# EAGLE design Schematic (EAGLE 9.1.0)
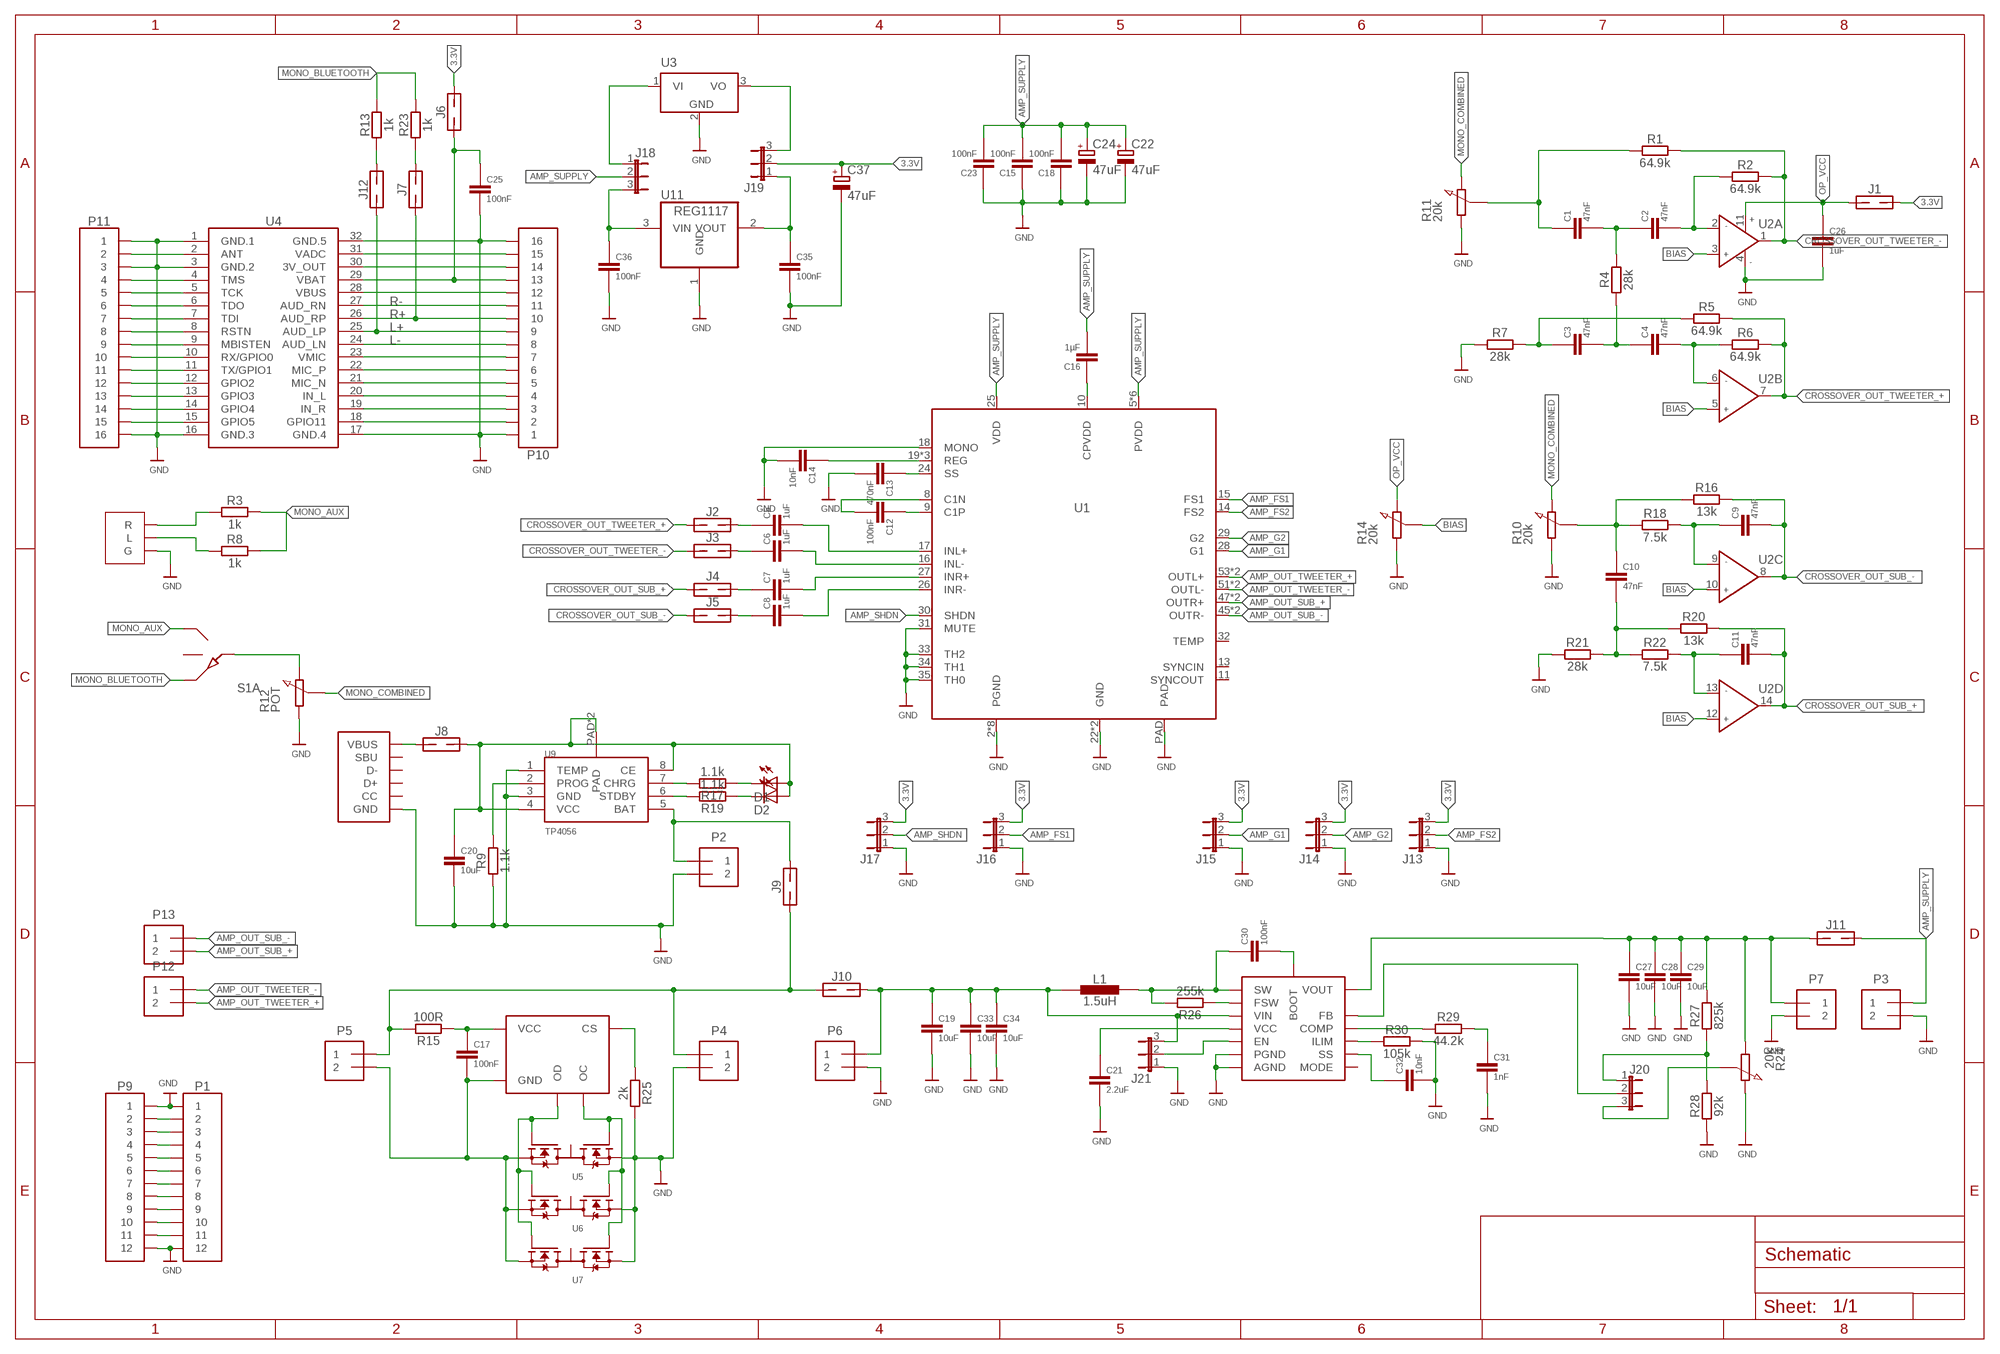
[diagram p0: schematic, sheet 1]

## Parts
C1  47nF  CAPACITOR  [R0603]
C2  47nF  CAPACITOR  [R0603]
C3  47nF  CAPACITOR  [R0603]
C4  47nF  CAPACITOR  [R0603]
C5  1uF  CAPACITOR  [R0603]
C6  1uF  CAPACITOR  [R0603]
C7  1uF  CAPACITOR  [R0603]
C8  1uF  CAPACITOR  [R0603]
C9  47nF  CAPACITOR  [R0603]
C10  47nF  CAPACITOR  [R0603]
C11  47nF  CAPACITOR  [R0603]
C12  100nF  CAPACITOR  [R0603]
C13  470nF  CAPACITOR  [R0603]
C14  10nF  CAPACITOR  [R0603]
C15  100nF  CAPACITOR  [R0603]
C16  1µF  CAPACITOR  [R0603]
C17  100nF  CAPACITOR  [R0603]
C18  100nF  CAPACITOR  [R0603]
C19  10uF  CAPACITOR1206  [1206]
C20  10uF  CAPACITOR1206  [1206]
C21  2.2uF  CAPACITOR  [R0603]
C22  47uF  CPOL-EUE2-4  [E2-4]
C23  100nF  CAPACITOR  [R0603]
C24  47uF  CPOL-EUE2-4  [E2-4]
C25  100nF  CAPACITOR  [R0603]
C26  1uF  CAPACITOR  [R0603]
C27  10uF  CAPACITOR1206  [1206]
C28  10uF  CAPACITOR1206  [1206]
C29  10uF  CAPACITOR1206  [1206]
C30  100nF  CAPACITOR  [R0603]
C31  1nF  CAPACITOR  [R0603]
C32  10nF  CAPACITOR  [R0603]
C33  10uF  CAPACITOR1206  [1206]
C34  10uF  CAPACITOR1206  [1206]
C35  100nF  CAPACITOR  [R0603]
C36  100nF  CAPACITOR  [R0603]
C37  47uF  CPOL-EUE2-4  [E2-4]
D1  LEDCHIPLED_0805  [CHIPLED_0805]
D2  LEDCHIPLED_0805  [CHIPLED_0805]
J1  JUMPER_2  [PIN_HEADER_2_2]
J2  JUMPER_2  [PIN_HEADER_2_2]
J3  JUMPER_2  [PIN_HEADER_2_2]
J4  JUMPER_2  [PIN_HEADER_2_2]
J5  JUMPER_2  [PIN_HEADER_2_2]
J6  JUMPER_2  [PIN_HEADER_2_2]
J7  JUMPER_2  [PIN_HEADER_2_2]
J8  JUMPER_2  [PIN_HEADER_2_2]
J9  JUMPER_2  [PIN_HEADER_2_2]
J10  JUMPER_2  [PIN_HEADER_2_2]
J11  JUMPER_2  [PIN_HEADER_2_2]
J12  JUMPER_2  [PIN_HEADER_2_2]
J13  JP2E  [JP2]
J14  JP2E  [JP2]
J15  JP2E  [JP2]
J16  JP2E  [JP2]
J17  JP2E  [JP2]
J18  JP2E  [JP2]
J19  JP2E  [JP2]
J20  JP2E  [JP2]
J21  JP2E  [JP2]
L1  1.5uH  INDUCTOR6519  [INDUCTOR2345]
P1  TYPE-_BREAKOUT  [TYPE-C]
P2  HEADER_2TERM  [SCREW_TERMINAL_2P]
P3  HEADER_2TERM  [SCREW_TERMINAL_2P]
P4  HEADER_2TERM  [SCREW_TERMINAL_2P]
P5  HEADER_2TERM  [SCREW_TERMINAL_2P]
P6  HEADER_2TERM  [SCREW_TERMINAL_2P]
P7  HEADER_2TERM  [SCREW_TERMINAL_2P]
P8  AUX  [AUDIO]
P9  HEADER_12  [HEADER_12]
P10  HEADER_16  [HEADER_16]
P11  HEADER_16  [HEADER_16]
P12  HEADER_2TERM  [SCREW_TERMINAL_2P]
P13  HEADER_2TERM  [SCREW_TERMINAL_2P]
P14  TYPE-C  [TYPE-C]
R1  64.9k  RESISTOR0603  [R0603]
R2  64.9k  RESISTOR0603  [R0603]
R3  1k  RESISTOR0603  [R0603]
R4  28k  RESISTOR0603  [R0603]
R5  64.9k  RESISTOR0603  [R0603]
R6  64.9k  RESISTOR0603  [R0603]
R7  28k  RESISTOR0603  [R0603]
R8  1k  RESISTOR0603  [R0603]
R9  1.1k  RESISTOR0603  [R0603]
R10  20k  POTTRIMMER  [TRIMMER]
R11  20k  POTTRIMMER  [TRIMMER]
R12  POT  [POT]
R13  1k  RESISTOR0603  [R0603]
R14  20k  POTTRIMMER  [TRIMMER]
R15  100R  RESISTOR0603  [R0603]
R16  13k  RESISTOR0603  [R0603]
R17  1.1k  RESISTOR0603  [R0603]
R18  7.5k  RESISTOR0603  [R0603]
R19  1.1k  RESISTOR0603  [R0603]
R20  13k  RESISTOR0603  [R0603]
R21  28k  RESISTOR0603  [R0603]
R22  7.5k  RESISTOR0603  [R0603]
R23  1k  RESISTOR0603  [R0603]
R24  20k  POTTRIMMER  [TRIMMER]
R25  2k  RESISTOR0603  [R0603]
R26  255k  RESISTOR0603  [R0603]
R27  825k  RESISTOR0603  [R0603]
R28  92k  RESISTOR0603  [R0603]
R29  44.2k  RESISTOR0603  [R0603]
R30  105k  RESISTOR0603  [R0603]
S1  SWITCH  [FE06]
U1  MAX9709  [TQFN-EP]
U2  MAX4478  [TSSOP-14]
U3  TSR12433  [TSR1]
U4  WIRELESS-BLUETOOTH-BK8000  [WIRELESS-BLUETOOTH-BK8000]
U5  FS8205  [SOP65P640X120-8N]
U6  FS8205  [SOP65P640X120-8N]
U7  FS8205  [SOP65P640X120-8N]
U8  FS312F  [TSOT23-6]
U9  TP4056  [SOP-8]
U10  TPS61088  [QFN50P450X350X100-21N]
U11  REG1117  [SOT223]

## Nets
3.3V: C37.+ J1.2 J6.2 J13.3 J14.3 J15.3 J16.3 J17.3 J19.2
AMP_FS1: J16.2 U1.15(FS1)
AMP_FS2: J13.2 U1.14(FS2)
AMP_G1: J15.2 U1.28(G1)
AMP_G2: J14.2 U1.29(G2)
AMP_OUT_SUB_+: P13.P$2 U1.47(OUTR+) U1.48(OUTR+)
AMP_OUT_SUB_-: P13.P$1 U1.45(OUTR-) U1.46(OUTR-)
AMP_OUT_TWEETER_+: P12.P$2 U1.53(OUTL+) U1.54(OUTL+)
AMP_OUT_TWEETER_-: P12.P$1 U1.51(OUTL-) U1.52(OUTL-)
AMP_SHDN: J17.2 U1.30(SHDN)
AMP_SUPPLY: C15.2 C16.2 C18.2 C22.+ C23.2 C24.+ J11.2 J18.2 P3.P$1 U1.5(PVDD) U1.6(PVDD) U1.7(PVDD) U1.25(VDD) U1.36(PVDD) U1.37(PVDD) U1.38(PVDD)
BIAS: R14.2 U2.3(A:IN+) U2.5(B:IN+) U2.10(C:IN+) U2.12(D:IN+)
CROSSOVER_OUT_SUB_+: C11.2 J4.1 R20.2 U2.14(D:OUT)
CROSSOVER_OUT_SUB_-: C9.2 J5.1 R16.2 U2.8(C:OUT)
CROSSOVER_OUT_TWEETER_+: J2.1 R5.2 R6.2 U2.7(B:OUT)
CROSSOVER_OUT_TWEETER_-: J3.1 R1.2 R2.2 U2.1(A:OUT)
GND: C13.2 C14.2 C15.1 C18.1 C19.2 C20.2 C21.2 C22.- C23.1 C24.- C25.2 C26.2 C27.2 C28.2 C29.2 C31.2 C32.2 C33.2 C34.2 C35.2 C36.2 C37.- J13.1 J14.1 J15.1 J16.1 J17.1 J21.1 P1.A1/B12 P1.B1/A12 P1.P$1 P1.P$2 P1.P$3 P1.P$4 P1.P$5 P1.P$6 P1.P$7 P1.P$8 P1.P$9 P1.P$10 P1.P$11 P1.P$12 P1.P$13 P1.P$14 P1.P$15 P1.P$16 P1.P$17 P1.P$18 P1.P$19 P1.P$20 P1.P$21 P1.P$22 P1.P$23 P1.P$24 P1.P$25 P1.P$26 P1.P$27 P1.P$28 P1.P$29 P1.P$30 P1.P$31 P1.P$32 P1.P$33 P1.P$34 P1.P$35 P1.P$36 P1.P$37 P1.P$38 P2.P$2 P3.P$2 P4.P$2 P6.P$2 P7.P$2 P8.P$3(G) P9.1 P9.12 P10.1 P10.16 P11.1 P11.3 P11.16 P14.A1/B12(GND) P14.B1/A12(GND) P14.P$1(GND) P14.P$2(GND) P14.P$3(GND) P14.P$4(GND) P14.P$5(GND) P14.P$6(GND) P14.P$7(GND) P14.P$8(GND) P14.P$9(GND) P14.P$10(GND) P14.P$11(GND) P14.P$12(GND) P14.P$13(GND) P14.P$14(GND) P14.P$15(GND) P14.P$16(GND) P14.P$17(GND) P14.P$18(GND) P14.P$19(GND) P14.P$20(GND) P14.P$21(GND) P14.P$22(GND) P14.P$23(GND) P14.P$24(GND) P14.P$25(GND) P14.P$26(GND) P14.P$27(GND) P14.P$28(GND) P14.P$29(GND) P14.P$30(GND) P14.P$31(GND) P14.P$32(GND) P14.P$33(GND) P14.P$34(GND) P14.P$35(GND) P14.P$36(GND) P14.P$37(GND) P14.P$38(GND) R7.1 R9.1 R10.1 R11.1 R12.1 R14.1 R21.1 R24.3 R25.2 R28.1 R30.2 U1.2(PGND) U1.3(PGND) U1.4(PGND) U1.18(MONO) U1.22(GND) U1.23(GND) U1.31(MUTE) U1.33(TH2) U1.34(TH1) U1.35(TH0) U1.39(PGND) U1.40(PGND) U1.41(PGND) U1.49(PGND) U1.50(PGND) U1.PAD U2.4(A:-) U3.2(GND) U4.1(GND.1) U4.3(GND.2) U4.16(GND.3) U4.17(GND.4) U4.32(GND.5) U5.6(S2) U5.7(S2) U6.6(S2) U6.7(S2) U7.6(S2) U7.7(S2) U9.1(TEMP) U9.3(GND) U10.20(AGND) U10.21(PGND) U10.22(PGND) U11.1(GND)
L+: J12.1 P10.9 U4.25(AUD_LP)
L-: P10.8 U4.24(AUD_LN)
MONO_AUX: R3.2 R8.2 S1.P$1
MONO_BLUETOOTH: R13.2 R23.2 S1.P$3
MONO_COMBINED: R10.3 R11.3 R12.2
N$1: C5.1 J2.2
N$2: C1.2 C2.1 R4.2
N$3: C2.2 R2.1 U2.2(A:IN-)
N$4: C1.1 R1.1 R11.2
N$5: C27.1 C28.1 C29.1 J11.1 P7.P$1 R24.1 R27.2 U10.14(VOUT) U10.15(VOUT) U10.16(VOUT)
N$6: C4.2 R6.1 U2.6(B:IN-)
N$7: C3.2 C4.1 R4.1
N$8: C3.1 R5.1 R7.2
N$9: C6.1 J3.2
N$10: C9.1 R18.2 U2.9(C:IN-)
N$11: C7.1 J4.2
N$12: C11.1 R22.2 U2.13(D:IN-)
N$13: C10.1 R10.2 R16.1 R18.1
N$14: C10.2 R20.1 R21.2 R22.1
N$15: C8.1 J5.2
N$16: C6.2 U1.16(INL-)
N$17: C36.1 J18.3 U11.3(VIN)
N$18: P8.P$1(L) R8.1
N$19: P8.P$2(R) R3.1
N$20: R12.3 S1.P$5(A:C)
N$21: C7.2 U1.27(INR+)
N$22: C8.2 U1.26(INR-)
N$23: C5.2 U1.17(INL+)
N$24: C12.2 U1.8(C1N)
N$25: C12.1 U1.9(C1P)
N$26: C13.1 U1.24(SS)
N$27: P1.A4/B9 P9.2
N$28: C14.1 U1.19(REG) U1.20(REG) U1.21(REG)
N$29: P1.B8 P9.3
N$30: P1.A5 P9.4
N$31: P1.B7 P9.5
N$32: P1.A6 P9.6
N$33: P1.A7 P9.7
N$34: C16.1 U1.10(CPVDD)
N$35: U5.5(G2) U6.5(G2) U7.5(G2) U8.3(OC)
N$36: C20.1 D1.A D2.A J8.2 U9.4(VCC) U9.8(CE) U9.PAD U9.PAD2(PAD)
N$37: R9.2 U9.2(PROG)
N$38: J19.3 U3.3(VO)
N$39: R17.2 U9.7(CHRG)
N$40: R19.2 U9.6(STDBY)
N$41: D1.C R17.1
N$42: D2.C R19.1
N$43: J9.2 P2.P$1 U9.5(BAT)
N$44: J8.1 P14.A4/B9(VBUS) P14.B4/A9(VBUS)
N$45: R26.1 U10.3(FSW)
N$46: P1.B6 P9.8
N$47: P1.A8 P9.9
N$48: P1.B5 P9.10
N$49: P1.B4/A9 P9.11
N$50: C35.1 J19.1 U11.2(VOUT)
N$74: R25.1 U8.2(CS)
N$75: C17.1 R15.1 U8.5(VCC)
N$76: C17.2 P5.P$2 U5.2(S1) U5.3(S1) U6.2(S1) U6.3(S1) U7.2(S1) U7.3(S1) U8.6(GND)
N$77: J9.1 J10.1 P4.P$1 P5.P$1 R15.2
N$78: U5.4(G1) U6.4(G1) U7.4(G1) U8.1(OD)
N$79: C30.1 L1.P$2 R26.2 U10.4(SW) U10.5(SW) U10.6(SW) U10.7(SW)
N$80: C30.2 U10.8(BOOT)
N$81: C21.1 U10.1(VCC)
N$82: C19.1 C33.1 C34.1 J10.2 J21.3 L1.P$1 P6.P$1 U10.9(VIN)
N$83: J21.2 U10.2(EN)
N$84: R30.1 U10.19(ILIM)
N$85: R29.1 U10.18(COMP)
N$86: C31.1 R29.2
N$87: J20.2 U10.17(FB)
N$88: C32.1 U10.10(SS)
N$89: J20.1 R27.1 R28.2
N$90: J20.3 R24.2
N$92: P10.2 U4.18(GPIO11)
N$93: P10.3 U4.19(IN_R)
N$94: P10.4 U4.20(IN_L)
N$95: P10.5 U4.21(MIC_N)
N$96: P10.6 U4.22(MIC_P)
N$97: P10.7 U4.23(VMIC)
N$102: P10.12 U4.28(VBUS)
N$103: C25.1 J6.1 P10.13 U4.29(VBAT)
N$104: P10.14 U4.30(3V_OUT)
N$105: P10.15 U4.31(VADC)
N$108: P11.2 U4.2(ANT)
N$110: P11.4 U4.4(TMS)
N$111: P11.5 U4.5(TCK)
N$112: P11.6 U4.6(TDO)
N$113: P11.7 U4.7(TDI)
N$114: P11.8 U4.8(RSTN)
N$115: P11.9 U4.9(MBISTEN)
N$116: P11.10 U4.10(RX/GPIO0)
N$117: P11.11 U4.11(TX/GPIO1)
N$118: P11.12 U4.12(GPIO2)
N$119: P11.13 U4.13(GPIO3)
N$120: P11.14 U4.14(GPIO4)
N$121: P11.15 U4.15(GPIO5)
N$123: J7.2 R23.1
N$124: J12.2 R13.1
OP_VCC: C26.1 J1.1 R14.3 U2.11(A:+)
R+: J7.1 P10.10 U4.26(AUD_RP)
R-: P10.11 U4.27(AUD_RN)
VI: J18.1 U3.1(VI)
Unconnected: P14.A5(CC) P14.A6(D+) P14.A7(D-) P14.A8(SBU) P14.B5(CC) P14.B6(D+) P14.B7(D-) P14.B8(SBU) S1.P$2 S1.P$6(B:C) S1.P$8 S1.P$9 S1.P$10 U1.11(SYNCOUT) U1.13(SYNCIN) U1.32(TEMP) U5.1(D12) U5.8(D12) U6.1(D12) U6.8(D12) U7.1(D12) U7.8(D12) U10.13(MODE)

## Library data of the parts
C1-C21 C23 C25-C36 = Schematic:CAPACITOR
C22 C24 C37 = Schematic:CPOL-EU: POLARIZED CAPACITOR, European symbol; SPICEPREFIX: C
D1 D2 = Schematic:LED: LED OSRAM: - CHIPLED LG R971, LG N971, LY N971, LG Q971, LY Q971, LO R971, LY R971 LH N974, LH R974 LS Q976, LO Q976, LY Q976 LO Q996 - Hyper CHIPLED LW Q18S LB Q993, LB Q99A, LB R99A - SideLED LS A670, LO A670, LY A670, LG A670, LP A670 LB A673, LV A673, LT A673, LW A673 LH A674 LY A675 LS A676, LA A676, LO A676, LY A676, LW A676 LS A679, LY A679, LG A679 - Hyper Micro SIDELED® LS Y876, LA Y876, LO Y876, LY Y876 LT Y87S - SmartLED LW L88C, LW L88S LB L89C, LB L89S, LG L890 LS L89K, LO L89K, LY L89K LS L896, LA L896, LO L896, LY L896 - TOPLED LS T670, LO T670, LY T670, LG T670, LP T670 LSG T670, LSP T670, LSY T670, LOP T670, LYG T670 LG T671, LOG T671, LSG T671 LB T673, LV T673, LT T673, LW T673 LH T674 LS T676, LA T676, LO T676, LY T676, LB T676, LH T676, LSB T676, LW T676 LB T67C, LV T67C, LT T67C, LS T67K, LO T67K, LY T67K, LW E67C LS E67B, LA E67B, LO E67B, LY E67B, LB E67C, LV E67C, LT E67C LW T67C LS T679, LY T679, LG T679 LS T770, LO T770, LY T770, LG T770, LP T770 LB T773, LV T773, LT T773, LW T773 LH T774 LS E675, LA E675, LY E675, LS T675 LS T776, LA T776, LO T776, LY T776, LB T776 LHGB T686 LT T68C, LB T68C - Hyper Mini TOPLED® LB M676 - Mini TOPLED Santana® LG M470 LS M47K, LO M47K, LY M47K Source: http://www.osram.convergy.de/
J1-J12 = Schematic:JUMPER_2
J13-J21 = Schematic:JP2E: JUMPER
L1 = Schematic:INDUCTOR
P1 = Schematic:TYPE-_BREAKOUT
P2-P7 P12 P13 = Schematic:HEADER_2
P8 = Schematic:AUX
P9 = Schematic:HEADER_12
P10 P11 = Schematic:HEADER_16
P14 = Schematic:TYPE-C
R1-R9 R13 R15-R23 R25-R30 = Schematic:RESISTOR
R10-R12 R14 R24 = Schematic:POT
S1 = Schematic:SWITCH
U1 = Schematic:MAX9709
U2 = Schematic:MAX4478
U3 = Schematic:TSR1: TRACO TSR-1 Series Point-of-Load DC/DC-Converters Vi max. 36 V; Vo = (1.2 .. 15)V ±2%; Io = 0 .. 1 A SIP-Package (drop-in replacement for 78xx linear voltage regulators in TO220-package, vertically assembled) Source: www.tracopower.com Technologies: TSR 1- Vi (V) Vo (V) ±2% Io = 0 .. 1 A 24_ ( generic ) 2412 4.6 .. 36 1.2 2415 4.6 .. 36 1.5 2418 4.6 .. 36 1.8 2425 4.6 .. 36 2.5 2433 4.75.. 36 3.3 2450 6.5 .. 36 5.0 2465 9.0 .. 36 6.5 2490 12 .. 36 9.0 24120 15 .. 36 12 24150 18 .. 36 15 Author: Dipl.-Ing. FH Rainer Bayer HHN Hochschule Heilbronn, rainer.bayer@hs-heilbronn.de Ingenieurbüro ing-rb, mail@ing-rb.de
U4 = Schematic:WIRELESS-BLUETOOTH-BK8000
U5-U7 = Schematic:FS8205
U8 = Schematic:FS312F
U9 = Schematic:TP4056
U10 = Schematic:TPS61088
U11 = burr-brown:REG1117: 800mA and 1A Low Dropout (LDO) Positive Regulator 1.8V, 2.5V, 2.85V, 3.3V, 5V, and Adj; MPN: REG1117; OC_FARNELL: 1097566; OC_NEWARK: 14P6981

## Board
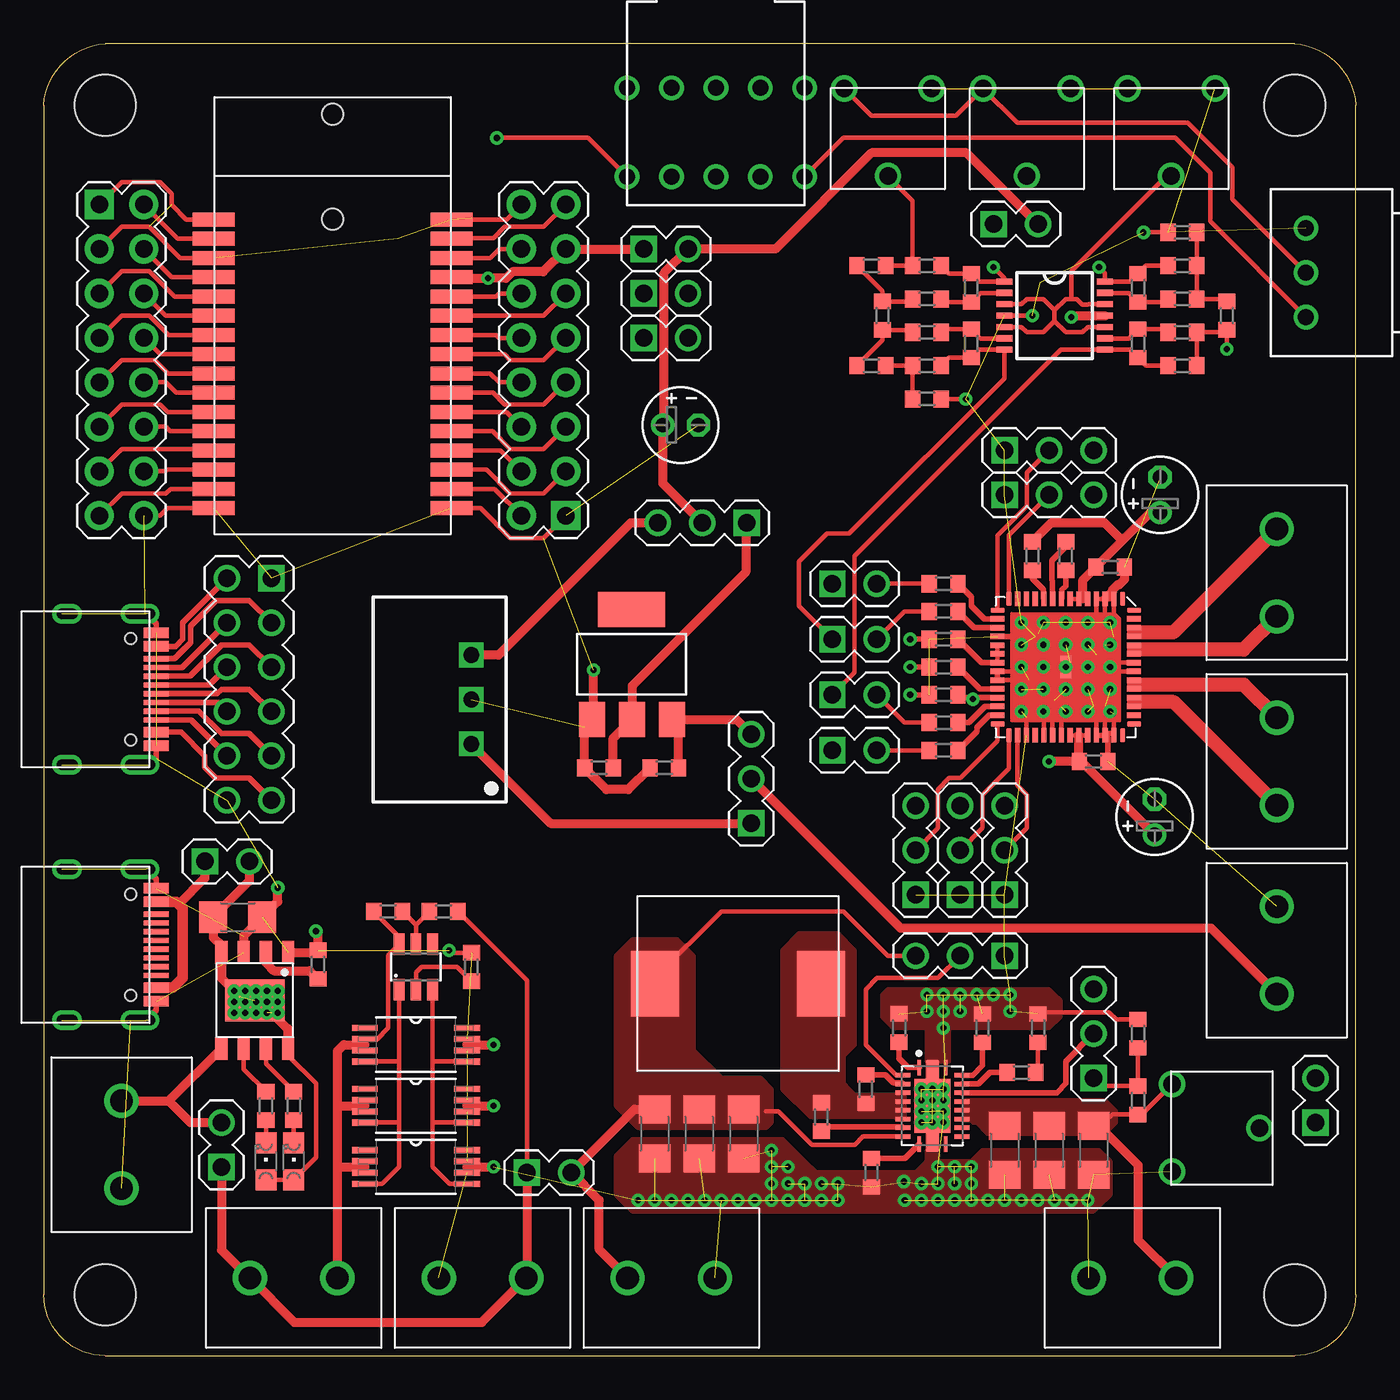
[diagram p1: board, top side]
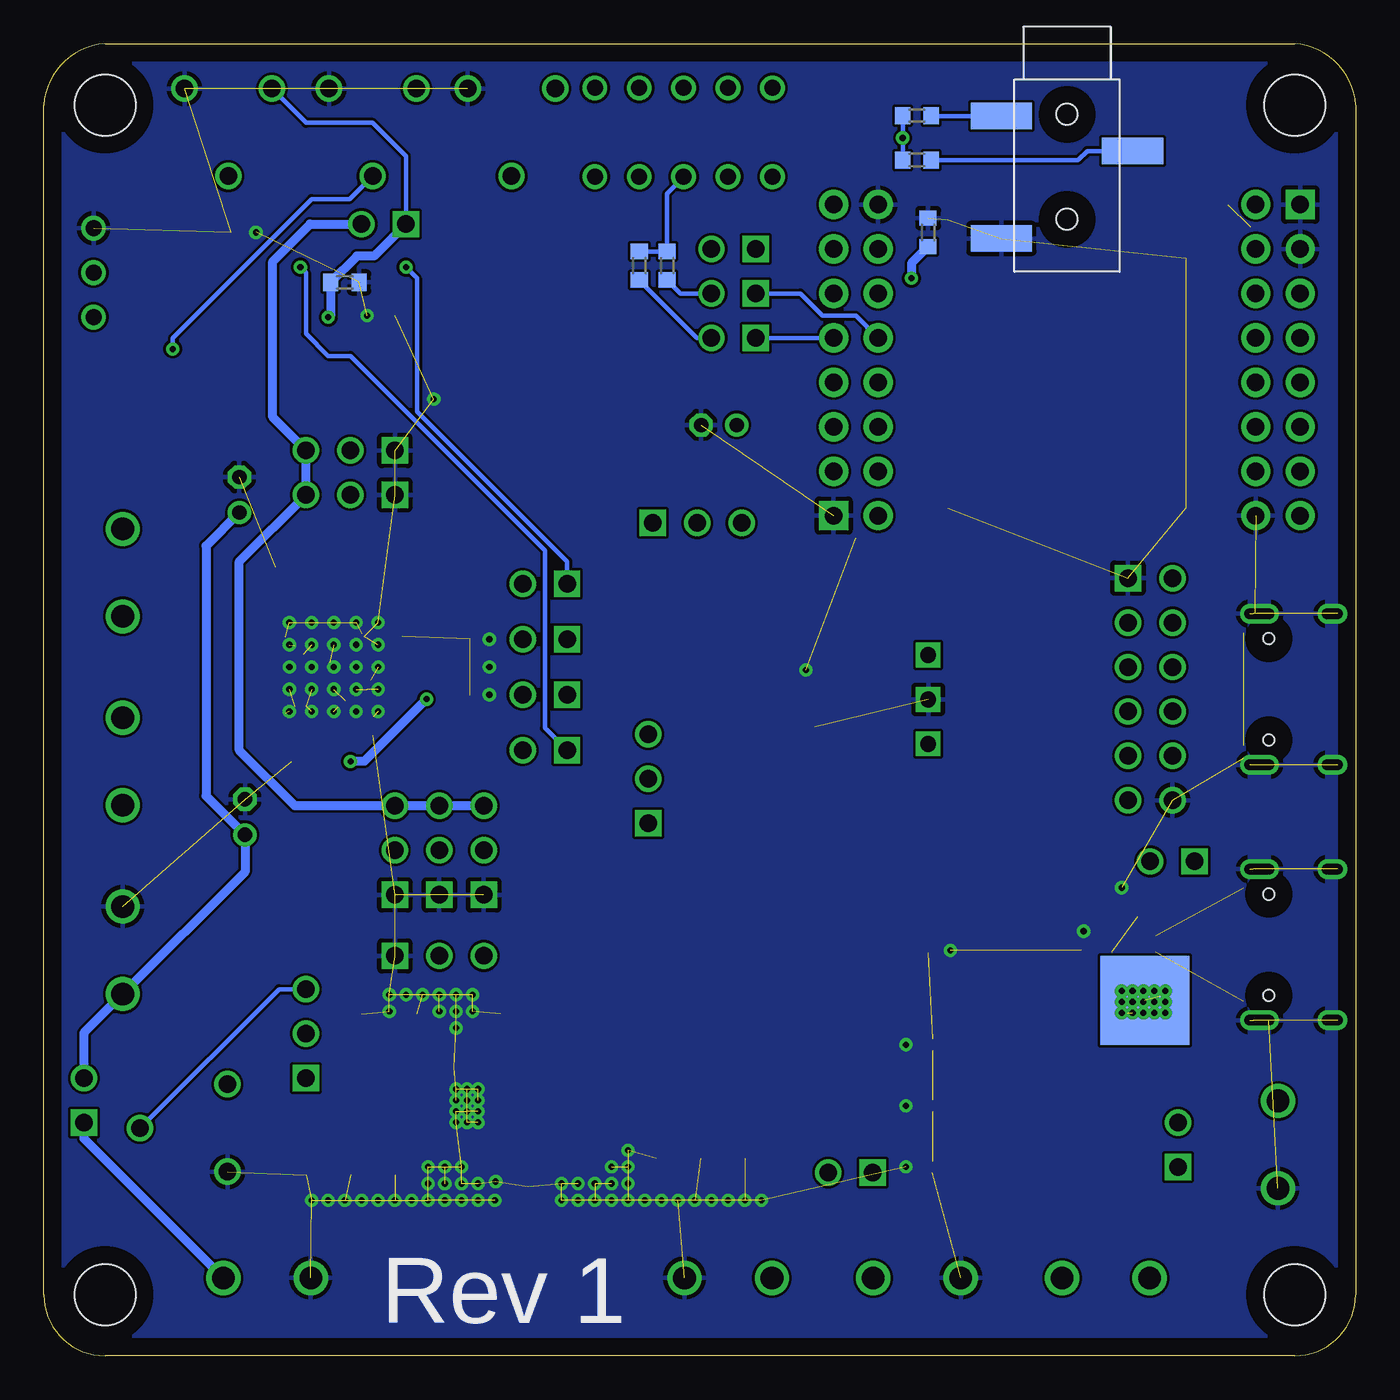
[diagram p2: board, bottom side, seen from below]

Size 75 x 75 mm. Coordinates in mm from the lower left corner, seen from the top.
Outline: 3.5,0 71.5,0 arc90 75,3.5 75,71.5 arc82 71.5,75 3.5,75 arc82 0,71.5 0,3.5 arc90 3.5,0
Copper layers (1*16): Top 0.035mm / dielectric 1.5mm / Bottom 0.035mm
Design rules "default": minimum track width 6mil, minimum drill 0.35mm, track to track 6mil, track to pad 6mil, pad to pad 6mil, via to via 6mil, smd to smd 6mil, copper to edge 40mil, drill to drill 6mil, minimum pad ring 10mil, minimum via ring 8mil, stop-mask expansion 4mil, vias tented up to drill 0mil, thermal gap 10mil
Holes 3.5 mm at 3.5,3.5 71.5,3.5 71.5,71.5 3.5,71.5

### Footprints (pad centres in the part's own frame; a part is rotated, then mirrored left to right if it is on the bottom)
R0603 = smd 0.87 x 0.98: 1 -0.815,0; 2 0.815,0
1206 = smd 1.6 x 1.8: 1 -1.4,0; 2 1.4,0
E2-4 = drill 0.813 pad 1.27: + -1.016,0 | drill 0.813 pad 1.27 octagon: - 1.016,0
CHIPLED_0805 = smd 1.2 x 1.2: A 0,-1.05; C 0,1.05
PIN_HEADER_2_2 = drill 1 square: 1 -1.27,0 | drill 1: 2 1.27,0
JP2 = drill 1 square: 1 -2.54,0 | drill 1: 2 0,0; 3 2.54,0
INDUCTOR2345 = smd 2.75 x 3.75: P$1 -4.75,0; P$2 4.75,0
TYPE-C = smd 0.6 x 1.45: A1/B12 -3.225,7.695; A4/B9 -2.45,7.695; B1/A12 3.225,7.695; B4/A9 2.45,7.695 | smd 0.3 x 1.45: A5 -1.25,7.695; A6 -0.25,7.695; A7 0.25,7.695; A8 1.25,7.695; B5 1.75,7.695; B6 0.75,7.695; B7 -0.75,7.695; B8 -1.75,7.695 | drill 0.6 pad 1: P$1 -4.32,6.23; P$2 -4.32,6.53; P$3 -4.32,6.63; P$4 -4.32,6.73; P$5 -4.32,6.33; P$6 -4.32,7.23; P$7 4.32,6.83; P$8 4.32,6.23; P$9 4.32,6.53; P$10 4.32,6.63; P$11 -4.32,7.13; P$12 -4.32,6.43; P$13 -4.32,6.83; P$14 4.32,6.73; P$15 4.32,6.33; P$16 4.32,7.23; P$17 4.32,6.43; P$18 4.32,7.13; P$19 4.32,7.33; P$20 4.32,2.9; P$21 4.32,2.3; P$22 4.32,2.6; P$23 4.32,2.7; P$24 4.32,2.8; P$25 4.32,2.4; P$26 4.32,2.5; P$27 -4.32,2.9; P$28 -4.32,2.3; P$29 -4.32,2.6; P$30 -4.32,2.7; P$31 -4.32,2.8; P$32 -4.32,2.4; P$33 -4.32,2.5; P$34 4.32,7.03; P$35 4.32,6.93; P$36 -4.32,7.33; P$37 -4.32,7.03; P$38 -4.32,6.93 | hole 0.65: -2.89,6.25; 2.89,6.25
SCREW_TERMINAL_2P = drill 1.3: P$1 -2.5,0; P$2 2.5,0
AUDIO = smd 1.5 x 3.5: P$1 5.1,-3.75; P$2 7.1,3.75; P$3 12.1,-3.75 | hole 1.2: 5,0; 11,0
HEADER_12 = drill 1 square: 1 -6.35,0 | drill 1: 2 -6.35,-2.54; 3 -3.81,0; 4 -3.81,-2.54; 5 -1.27,0; 6 -1.27,-2.54; 7 1.27,0; 8 1.27,-2.54; 9 3.81,0; 10 3.81,-2.54; 11 6.35,0; 12 6.35,-2.54
HEADER_16 = drill 1 pad 1.676 square: 1 -1.27,8.89 | drill 1 pad 1.676: 2 1.27,8.89; 3 -1.27,6.35; 4 1.27,6.35; 5 -1.27,3.81; 6 1.27,3.81; 7 -1.27,1.27; 8 1.27,1.27; 9 -1.27,-1.27; 10 1.27,-1.27; 11 -1.27,-3.81; 12 1.27,-3.81; 13 -1.27,-6.35; 14 1.27,-6.35; 15 -1.27,-8.89; 16 1.27,-8.89
TRIMMER = drill 1: 1 -2.5,-2.5; 2 0,2.5; 3 2.5,-2.5
POT = drill 0.914: 1 -2.54,0; 2 0,0; 3 2.54,0
FE06 = drill 0.914: P$1 -5.08,-5.08; P$2 -2.54,-5.08; P$3 0,-5.08; P$4 2.54,-5.08; P$5 5.08,-5.08; P$6 5.08,0; P$7 2.54,0; P$8 0,0; P$9 -2.54,0; P$10 -5.08,0
TQFN-EP = smd 0.813 x 0.31: 1 -3.9,3.25; 2 -3.9,2.75; 3 -3.9,2.25; 4 -3.9,1.75; 5 -3.9,1.25; 6 -3.9,0.75; 7 -3.9,0.25; 8 -3.9,-0.25; 9 -3.9,-0.75; 10 -3.9,-1.25; 11 -3.9,-1.75; 12 -3.9,-2.25; 13 -3.9,-2.75; 14 -3.9,-3.25; 29 3.9,-3.25; 30 3.9,-2.75; 31 3.9,-2.25; 32 3.9,-1.75; 33 3.9,-1.25; 34 3.9,-0.75; 35 3.9,-0.25; 36 3.9,0.25; 37 3.9,0.75; 38 3.9,1.25; 39 3.9,1.75; 40 3.9,2.25; 41 3.9,2.75; 42 3.9,3.25 | smd 0.31 x 0.813: 15 -3.25,-3.9; 16 -2.75,-3.9; 17 -2.25,-3.9; 18 -1.75,-3.9; 19 -1.25,-3.9; 20 -0.75,-3.9; 21 -0.25,-3.9; 22 0.25,-3.9; 23 0.75,-3.9; 24 1.25,-3.9; 25 1.75,-3.9; 26 2.25,-3.9; 27 2.75,-3.9; 28 3.25,-3.9; 43 3.25,3.9; 44 2.75,3.9; 45 2.25,3.9; 46 1.75,3.9; 47 1.25,3.9; 48 0.75,3.9; 49 0.25,3.9; 50 -0.25,3.9; 51 -0.75,3.9; 52 -1.25,3.9; 53 -1.75,3.9; 54 -2.25,3.9; 55 -2.75,3.9; 56 -3.25,3.9 | smd 1.27 x 0.635: PAD 0,0
TSSOP-14 = smd 0.9 x 0.35: 1 -2.875,1.95; 2 -2.875,1.3; 3 -2.875,0.65; 4 -2.875,0; 5 -2.875,-0.65; 6 -2.875,-1.3; 7 -2.875,-1.95; 8 2.875,-1.95; 9 2.875,-1.3; 10 2.875,-0.65; 11 2.875,0; 12 2.875,0.65; 13 2.875,1.3; 14 2.875,1.95
TSR1 = drill 0.9 square: 1 -2.54,0; 2 0,0; 3 2.54,0
WIRELESS-BLUETOOTH-BK8000 = smd 2.4 x 0.8: 1 -6.8,5.5; 2 -6.8,4.4; 3 -6.8,3.3; 4 -6.8,2.2; 5 -6.8,1.1; 6 -6.8,0; 7 -6.8,-1.1; 8 -6.8,-2.2; 9 -6.8,-3.3; 10 -6.8,-4.4; 11 -6.8,-5.5; 12 -6.8,-6.6; 13 -6.8,-7.7; 14 -6.8,-8.8; 15 -6.8,-9.9; 16 -6.8,-11; 17 6.8,-11; 18 6.8,-9.9; 19 6.8,-8.8; 20 6.8,-7.7; 21 6.8,-6.6; 22 6.8,-5.5; 23 6.8,-4.4; 24 6.8,-3.3; 25 6.8,-2.2; 26 6.8,-1.1; 27 6.8,0; 28 6.8,1.1; 29 6.8,2.2; 30 6.8,3.3; 31 6.8,4.4; 32 6.8,5.5
SOP65P640X120-8N = smd 1.473 x 0.356: 1 -2.921,0.965; 2 -2.921,0.33; 3 -2.921,-0.33; 4 -2.921,-0.965; 5 2.921,-0.965; 6 2.921,-0.33; 7 2.921,0.33; 8 2.921,0.965
TSOT23-6 = smd 0.62 x 1.22: 1 -0.95,-1.3; 2 0,-1.3; 3 0.95,-1.3; 4 0.95,1.3; 5 0,1.3; 6 -0.95,1.3
SOP-8 = smd 1.3 x 0.7: 1 -2.75,1.905; 2 -2.75,0.635; 3 -2.75,-0.635; 4 -2.75,-1.905; 5 2.75,-1.905; 6 2.75,-0.635; 7 2.75,0.635; 8 2.75,1.905 | smd 2.4 x 3.4: PAD 0,0 | smd 5.08 x 5.08 bottom: PAD2 0,0
QFN50P450X350X100-21N = smd 0.26 x 0.9: 1 -0.75,2.185; 10 -0.75,-2.185; 11 0.75,-2.185; 20 0.75,2.185 | smd 0.9 x 0.26: 2 -1.685,1.75; 3 -1.685,1.25; 4 -1.685,0.75; 5 -1.685,0.25; 6 -1.685,-0.25; 7 -1.685,-0.75; 8 -1.685,-1.25; 9 -1.685,-1.75; 12 1.685,-1.75; 13 1.685,-1.25; 14 1.685,-0.75; 15 1.685,-0.25; 16 1.685,0.25; 17 1.685,0.75; 18 1.685,1.25; 19 1.685,1.75 | smd 2.07 x 3.07: 21 0,0 | smd 0.75 x 5.27: 22 0,0
SOT223 = smd 1.499 x 2.007: 1 -2.261,-3.15; 2 0.025,-3.15; 3 2.311,-3.15 | smd 3.81 x 2.007: 4 0,3.15

### Placement (x,y rotation side)
C1  47.31,62.31 180 top
C2  50.48,60.41 0 top
C3  47.31,56.6 180 top
C4  50.48,58.5 0 top
C5  51.44,42.55 0 top
C6  51.44,44.13 0 top
C7  51.44,34.61 0 top
C8  51.44,36.2 0 top
C9  62.55,57.87 270 top
C10  67.63,59.45 90 top
C11  62.55,61.04 90 top
C12  58.42,45.72 270 top
C13  51.44,39.37 180 top
C14  51.44,40.96 180 top
C15  51.44,37.78 0 top
C16  56.52,45.72 90 top
C17  19.68,25.4 180 top
C18  60.01,33.97 180 top
C19  37.47,12.7 270 top
C20  11.1,25.08 0 top
C21  48.9,18.74 90 top
C22  63.5,30.8 90 top
C23  60.96,45.09 180 top
C24  63.82,49.21 90 top
C25  24.45,64.22 90 bottom
C26  57.78,61.36 0 bottom
C27  60.01,11.75 270 top
C28  57.47,11.75 270 top
C29  54.93,11.75 270 top
C30  44.45,13.65 270 top
C31  56.83,18.73 90 top
C32  47.31,10.48 270 top
C33  40.01,12.7 270 top
C34  34.92,12.7 270 top
C35  31.74,33.6 180 top
C36  35.47,33.6 180 top
C37  36.4,53.21 0 top
D1  14.29,11.11 0 top
D2  12.7,11.11 0 top
J1  55.56,64.69 0 top
J2  46.35,40.96 0 top
J3  46.35,44.13 0 top
J4  46.35,34.61 0 top
J5  46.35,37.78 0 top
J6  35.56,63.27 0 top
J7  35.56,60.73 0 top
J8  10.48,28.26 0 top
J9  10.16,12.06 90 top
J10  28.89,10.48 0 top
J11  72.71,14.61 90 top
J12  35.56,58.19 0 top
J13  57.47,49.21 0 top
J14  52.39,28.89 90 top
J15  49.85,28.89 90 top
J16  57.47,51.75 0 top
J17  54.93,28.89 90 top
J18  40.45,32.98 90 top
J19  37.65,47.61 180 top
J20  60.01,18.41 90 top
J21  52.39,22.86 180 top
L1  39.69,21.27 0 top
P1  -1.27,38.1 270 top
P2  4.45,12.06 270 top
P3  70.48,23.18 90 top
P4  25.08,4.45 180 top
P5  14.29,4.45 0 top
P6  35.88,4.45 0 top
P7  62.23,4.45 180 top
P8  16.51,75.97 270 bottom
P9  13.02,38.1 270 top
P10  28.57,56.91 180 top
P11  4.45,56.91 0 top
P12  70.48,44.77 90 top
P13  70.48,33.97 90 top
P14  -1.27,23.5 270 top
R1  50.48,62.31 0 top
R2  53.02,61.04 90 top
R3  25.08,68.34 180 bottom
R4  47.94,59.45 90 top
R5  50.48,56.6 0 top
R6  53.02,57.87 270 top
R7  50.48,54.69 180 top
R8  25.08,70.89 180 bottom
R9  15.68,22.36 270 top
R10  56.2,69.93 180 top
R11  48.26,69.93 180 top
R12  72.16,61.91 270 top
R13  40.96,62.31 90 bottom
R14  64.45,69.93 180 top
R15  22.86,25.4 0 top
R16  65.09,56.6 180 top
R17  14.29,14.29 90 top
R18  65.09,58.5 180 top
R19  12.7,14.29 90 top
R20  65.09,62.31 180 top
R21  65.09,64.22 0 top
R22  65.09,60.41 180 top
R23  39.37,62.31 90 bottom
R24  66.99,13.02 270 top
R25  24.45,22.23 90 top
R26  46.99,15.24 270 top
R27  62.55,14.61 270 top
R28  62.55,18.41 270 top
R29  55.88,16.19 0 top
R30  53.66,18.73 90 top
S1  38.42,72.47 0 top
U1  58.42,39.37 270 top
U2  57.78,59.45 0 top
U3  24.44,37.52 90 top
U4  16.51,59.45 0 top
U5  21.27,17.78 0 top
U6  21.27,10.79 0 top
U7  21.27,14.29 0 top
U8  21.27,22.23 0 top
U9  12.06,20.32 270 top
U10  50.8,14.29 0 top
U11  33.6,39.52 0 top

### Tracks (layer width: path | path; a pad name or v marks a point on that pad's centre or on a via)
3.3V
  Top 0.508: J1.2 52.76,68.76 47.32,68.76 41.82,63.27 J6.2 35.47,61.91 35.47,53.29 C37.+ 35.39,49.87 J19.2
  Bottom 0.508: J15.3 J14.3 J17.3 60.64,31.43 63.82,34.61 63.82,45.4 J13.3 J16.3 61.91,53.66 61.91,62.55 59.77,64.69 J1.2
AMP_FS1
  Top 0.254: U1.15 54.52,46.9 56.2,48.58 56.2,50.48 J16.2
AMP_FS2
  Top 0.254: J13.2 55.17,46.91 U1.14
AMP_G1
  Top 0.254: U1.28 54.52,35.15 52.39,33.02 51.75,33.02 51.12,32.38 51.12,30.16 J15.2
AMP_G2
  Top 0.254: U1.29 55.17,33.58 53.66,32.07 53.66,30.16 J14.2
AMP_OUT_SUB_+
  Top 0.254: U1.48 62.32,38.42 62.32,38.35 U1.47
  Top 0.813: P13.P$2 68.6,38.35 62.32,38.35
AMP_OUT_SUB_-
  Top 0.254: U1.46 62.32,37.36 U1.45
  Top 0.813: P13.P$1 64.59,37.36 62.32,37.36
AMP_OUT_TWEETER_+
  Top 0.254: U1.54 62.32,41.35 U1.53
  Top 0.813: P12.P$2 64.57,41.35 62.32,41.35
AMP_OUT_TWEETER_-
  Top 0.254: U1.52 62.32,40.36 U1.51
  Top 0.813: P12.P$1 68.58,40.36 62.32,40.36
AMP_SHDN
  Top 0.254: U1.30 55.67,32.59 56.2,32.07 56.2,30.16 J17.2
AMP_SUPPLY  (via drill 0.35)
  Top 0.254: U1.36 59.05,35.47 U1.37 U1.38 | U1.5 59.37,43.27 U1.6 U1.7 | C18.2 59.31,33.97 59.45,33.84
  Top 0.305: 52.41,37.62 C15.2 52.41,37.62 | 59.37,34.15 C18.2 59.12,33.9 | 52.41,37.62 53.21,37.62 | 53.21,37.62 U1.25 | 53.21,37.62 v53.12,37.53
  Top 0.508: 59.37,43.27 59.37,44.31 C23.2 61.66,46.6 | 59.45,33.84 C22.+ | C24.+ 63.26,48.2 61.66,46.6 | C16.2 57.6,47.62 60.64,47.62 61.66,46.6 | P3.P$1 66.72,24.45 48.98,24.45 J18.2 | U1.37 59.17,33.99 C18.2 v57.47,33.97
  Bottom 0.508: J11.2 72.71,18.45 P3.P$1 63.5,27.66 C22.+ 65.72,32 65.72,46.29 C24.+ | v53.12,37.53 56.68,33.97 v57.47,33.97
BIAS
  Top 0.254: U2.5 55.9,58.8 56.2,58.5 57.15,58.5 57.78,59.14 | U2.10 59.67,58.8 59.37,58.5 58.42,58.5 57.78,59.14 | U2.3 55.9,60.1 56.2,60.41 57.15,60.41 57.78,59.77 | U2.12 59.7,60.1 59.69,60.09 59.37,60.09 59.05,60.41 58.74,60.41 | 58.74,60.41 58.42,60.41 57.78,59.77 | 57.78,59.14 57.78,59.77 | R14.2 64.17,67.43 58.74,61.99 58.74,60.41
CROSSOVER_OUT_SUB_+  (via drill 0.35)
  Top 0.254: R20.2 63,62.31 C11.2 62.09,61.41 U2.14 60.66,61.9 v60.33,62.23
  Bottom 0.254: J4.1 46.35,35.88 46.35,46.04 57.47,57.15 58.74,57.15 60.01,58.42 60.01,61.91 v60.33,62.23
CROSSOVER_OUT_SUB_-
  Top 0.254: R16.2 63,56.6 C9.2 62.09,57.51 U2.8 58.14,57.51 46.35,45.72 46.35,39.05 J5.1
CROSSOVER_OUT_TWEETER_+
  Top 0.254: R5.2 51.75,57.05 R6.2 53.48,57.51 U2.7 54.91,55.86 46.04,46.99 44.77,46.99 43.18,45.4 43.18,42.86 J2.1
CROSSOVER_OUT_TWEETER_-  (via drill 0.35)
  Top 0.254: R1.2 51.75,61.86 R2.2 53.48,61.41 54.29,61.41 U2.1 54.91,61.61 v54.29,62.23
  Bottom 0.254: J3.1 45.09,45.4 53.66,53.98 53.66,61.59 v54.29,62.23
GND  (via drill 0.35)  (215 unrouted)
  Top 0.254: P11.16 6.67,48.02 7.1,48.45 U4.16 | P11.3 4.45,64.53 6.03,64.53 7.81,62.76 U4.3 | P11.1 4.45,67.08 6.67,67.08 7.3,66.44 7.3,65.81 8.15,64.95 U4.1 | P10.16 26.45,64.95 U4.32 | P10.1 28.57,46.76 26.67,46.76 24.97,48.45 U4.17 | R21.1 v62.87,64.22 | R7.1 v52.7,54.69 | v56.52,59.45 U2.4 | U1.3 U1.2 61.17,41.1 60.67,40.6 | U1.3 U1.4 60.17,40.1 | U1.50 59.69,39.62 | 59.69,39.62 58.67,39.62 U1.PAD | U1.3 60.67,40.6 | 60.67,40.6 60.17,40.1 | 60.17,40.1 59.69,39.62 | U1.22 56.77,39.12 56.83,39.05 v57.15,39.37 U1.PAD | U1.23 56.31,38.62 56.52,38.42 56.52,38.1 55.88,37.47 56.17,37.17 56.17,36.51 | U1.31 56.17,36.51 | U1.34 57.67,37.35 57.78,37.47 | U1.35 58.17,37.08 | 58.17,37.08 57.78,37.47 | U1.39 60.17,36.98 | 60.17,36.98 60.01,37.15 58.24,37.15 58.17,37.08 | U1.41 61.17,35.56 61.17,36.72 61.28,36.83 | U1.49 61.53,39.12 61.28,39.37 v60.96,39.37 v59.69,39.37 U1.PAD | U1.40 60.67,37.12 | 60.67,37.12 60.64,37.15 | 60.17,36.98 60.3,37.12 60.67,37.12 | U1.33 57.17,36.81 | 57.17,36.81 v57.15,36.83 56.49,36.83 56.17,36.51 | 57.17,36.81 57.78,37.42 57.78,37.47 | 60.9,19.64 61.3,19.23 R28.1 | R25.2 23.32,23.04 v23.18,23.18 | U6.7 24.19,10.79 U6.6 | U7.7 24.19,14.29 U7.6 | U5.7 24.19,17.78 U5.6 | 60.9,19.64 | 60.9,19.64 56.92,19.64 C31.2
  Top 0.305: U1.39 U1.40 | U1.40 60.76,35.56 61.17,35.56 | U1.22 U1.23 | C14.2 v49.53,40.96 | C13.2 v49.53,39.37 | C15.1 v49.53,37.78 | C18.1 60.82,35.32 U1.40 | U1.18 56.68,41.12 56.83,41.27 | P1.A1/B12 6.42,41.85 P1.P$11 | P1.B1/A12 6.42,34.15 P1.P$19 | P14.B1/A12 6.42,19.74 P14.P$18 | P14.A1/B12 6.42,27.25 P14.P$11
  Top 0.508: C23.1 61.77,44.38 61.48,44.08 61.39,44.08 61.11,43.8 61.11,43.71 U1.3 | 24.19,17.78 v25.72,17.78 | 24.19,14.29 v25.72,14.29 | 24.19,10.79 v25.72,10.79 | 56.68,41.12 56.68,41.11 v57.15,40.64 | v31.43,39.2 31.43,36.45 U11.1 30.92,35.95 C35.2 32.17,32.36 33.41,32.36 C36.2 | U9.3 11.43,24.01 C20.2 13.38,25.96 v13.38,26.76 | U9.1 15.57,23.07 R9.1 15.68,24.15 v15.56,24.27
  other vias: 58.42,39.37 55.88,41.91 57.15,41.91 58.42,41.91 59.69,41.91 60.96,41.91 55.88,40.64 58.42,40.64 59.69,40.64 60.96,40.64 55.88,39.37 55.88,38.1 57.15,38.1 58.42,38.1 59.69,38.1 60.96,38.1 60.96,36.83 59.69,36.83 58.42,36.83 55.88,36.83 50.16,15.24 50.8,15.24 51.44,15.24 50.16,14.61 50.8,14.61 51.44,14.61 51.44,13.97 50.16,13.97 50.16,13.34 51.44,13.34 50.8,13.34 50.8,13.97 33.97,8.89 34.92,8.89 35.88,8.89 36.83,8.89 37.78,8.89 38.73,8.89 39.69,8.89 40.64,8.89 41.59,8.89 42.55,8.89 43.5,8.89 44.45,8.89 45.4,8.89 49.21,8.89 50.16,8.89 51.12,8.89 52.07,8.89 53.02,8.89 53.98,8.89 54.93,8.89 55.88,8.89 56.83,8.89 57.78,8.89 58.74,8.89 59.69,8.89 50.48,19.68 50.48,20.64 51.44,20.64 51.44,19.68 51.44,18.73 52.39,19.68 52.39,20.64 53.34,20.64 54.29,20.64 55.24,20.64 55.24,19.68 41.59,11.75 41.59,10.79 42.55,10.79 41.59,9.84 42.55,9.84 43.5,9.84 44.45,9.84 45.4,9.84 51.12,10.79 52.07,10.79 53.02,10.79 53.02,9.84 52.07,9.84 51.12,9.84 50.16,9.84 49.16,9.96
  pour Bottom: 0,75 75,75 75,0 0,0
  pour Top (no thermals): 50.48,16.83 50.48,18.73 50.48,18.74 48.57,18.74 47.94,19.37 47.94,20.64 48.26,20.95 57.47,20.95 57.78,20.64 58.1,20.32 58.1,19.37 57.47,18.73 51.77,18.73 51.75,18.72 51.75,16.83
  pour Top (no thermals): 53.66,11.75 60.01,11.75 60.33,11.75 60.96,11.11 60.96,9.21 60.33,8.57 60.01,8.26 54.61,8.26 33.66,8.26 32.7,9.21 32.7,11.43 33.66,12.38 34.29,12.38 42.23,12.38 43.5,11.11 44.13,10.48 49.85,10.48 50.48,11.11 50.48,11.75 51.12,11.75 51.12,11.11 53.02,11.11
L+
  Top 0.254: P10.9 28.57,56.91 26.67,56.91 26.33,57.26 U4.25
  Bottom 0.254: J12.1 P10.9
L-
  Top 0.254: P10.8 26.04,55.65 25.52,56.16 24.77,56.16 U4.24
MONO_AUX  (via drill 0.35)
  Top 0.254: S1.P$1 31.11,69.61 v25.9,69.61
  Bottom 0.254: R3.2 v25.9,69.61 R8.2
MONO_BLUETOOTH
  Bottom 0.254: R13.2 R23.2 39.37,66.44 S1.P$3
MONO_COMBINED
  Top 0.254: R11.3 47.31,70.89 52.15,70.89 R10.3 55.65,70.48 65.41,70.48 67.94,67.94 67.94,66.12 R12.2
N$1
  Top 0.254: J2.2 49.21,42.55 C5.1
N$2
  Top 0.254: C2.1 49.53,60.27 R4.2 47.94,60.86 C1.2
N$3
  Top 0.254: U2.2 53.55,60.76 R2.1 51.48,60.23 C2.2
N$4
  Top 0.254: C1.1 R1.1 49.67,66.03 R11.2
N$5
  Top 0.254: 64.33,15.36 R24.1 62.71,13.73 62.55,13.73 | R27.2 61.1,13.79 60.96,13.65
  Top 0.305: 62.55,13.73 R27.2
  Top 0.508: R27.2 62.77,13.79 | P7.P$1 62.55,6.62 62.55,10.91 60.32,13.15 C27.1
  Bottom 0.508: J11.1 72.71,12.42 P7.P$1
  pour Top (no thermals): 53.97,14.6 52.7,14.6 52.7,13.34 53.34,13.34 53.34,13.33 53.97,12.7 58.42,12.7 60.64,12.7 60.96,13.02 61.28,13.34 61.28,13.65 61.28,13.97 60.65,14.6
N$6
  Top 0.254: U2.6 53.55,58.16 R6.1 51.48,58.68 C4.2
N$7
  Top 0.254: C4.1 49.53,58.64 R4.1 47.94,58.05 C3.2
N$8
  Top 0.254: C3.1 48.9,56.6 R5.1 R7.2
N$9
  Top 0.254: J3.2 C6.1
N$10
  Top 0.254: U2.9 62.02,58.16 C9.1 64.09,58.68 | 64.09,58.68 R18.2 64.09,58.68
N$11
  Top 0.254: J4.2 C7.1
N$12
  Top 0.254: U2.13 62.02,60.76 C11.1 64.09,60.23 R22.2
N$13  (via drill 0.35)
  Top 0.254: 65.9,57.55 65.9,57.47 | 65.9,57.47 R16.1 | 65.9,57.47 R18.1 67.49,58.5 C10.1 v67.63,57.55
  Bottom 0.254: R10.2 57.51,66.12 59.69,66.12 67.63,58.19 v67.63,57.55
N$14
  Top 0.254: R21.2 R20.1 R22.1 67.49,60.41 C10.2
N$15
  Top 0.254: J5.2 49.21,36.2 C8.1
N$16
  Top 0.305: C6.2 53.02,43.36 53.02,42.86 53.77,42.12 U1.16
N$17
  Top 0.508: C36.1 36.29,36 U11.3 39.6,36.37 J18.3
N$18
  Bottom 0.254: P8.P$1 24.25,70.86 R8.1
N$19
  Bottom 0.254: P8.P$2 15.36,68.86 15.88,68.34 R3.1
N$20
  Top 0.254: S1.P$5 45.72,69.61 64.69,69.61 66.67,67.63 66.67,64.85 R12.3
N$21
  Top 0.305: C7.2 53.34,35.7 53.34,35.9 54.06,36.62 U1.27
N$22
  Top 0.305: U1.26 53.81,37.12 52.88,36.2 C8.2
N$23
  Top 0.305: C5.2 53.17,41.62 U1.17
N$24
  Top 0.305: C12.2 58.42,44.01 58.21,43.8 58.21,43.31 U1.8
N$25
  Top 0.305: C12.1 58.42,46.26 57.62,45.47 57.62,44.34 57.67,44.3 U1.9
N$26
  Top 0.305: C13.1 53.5,38.12 U1.24
N$27
  Top 0.305: P1.A4/B9 7.53,40.55 7.94,40.96 7.94,41.91 P9.2
N$28
  Top 0.254: U1.19 U1.20 U1.21
  Top 0.305: C14.1 53.59,39.62 U1.21
N$29
  Top 0.305: P1.B8 7.48,39.85 8.39,40.77 8.39,41.72 9.85,43.17 11.75,43.17 P9.3
N$30
  Top 0.305: P1.A5 7.92,39.35 P9.4
N$31
  Top 0.305: P1.B7 8.37,38.85 10.16,40.64 11.75,40.64 P9.5
N$32
  Top 0.305: P1.A6 9.46,38.35 P9.6
N$33
  Top 0.305: P1.A7 9.91,37.85 10.16,38.1 11.75,38.1 P9.7
N$34
  Top 0.305: C16.1 56.52,44.42 57.13,43.8 57.13,43.31 U1.10
N$35
  Top 0.254: U8.3 22.22,16.83 | 22.22,16.83 22.22,13.34 | 22.22,13.34 22.22,12.38 22.23,12.38 22.23,10.79 23.19,9.83 U6.5 | U7.5 24.18,13.34 22.22,13.34 | U5.5 24.18,16.83 22.22,16.83
N$36  (via drill 0.35)  (3 unrouted)
  Top 0.152: U9.8 13.97,17.14
  Top 0.254: U9.4 10.16,22.86 | 13.97,17.14 15.56,15.56 15.56,11.33 D1.A D2.A
  Top 0.508: 11.2,20.54 v10.89,20.85 10.16,21.58 U9.4 10.16,23.44 9.7,23.9 C20.1 11.75,27.13 J8.2 | 13.97,18.67 13.97,18.7 | 13.07,19.6 12.76,19.91 | 12.78,19.6 U9.PAD2 12.32,20.32 13.97,18.67 | U9.8 13.97,18.67
N$37
  Top 0.508: U9.2 12.7,22.46 13.15,22.01 15.21,22.01 R9.2
N$38
  Top 0.508: 24.76,40.06 24.58,40.06 | 24.58,40.06 U3.3 26,40.06 33.55,47.61 J19.3 | 24.58,40.14 24.58,40.06
N$39
  Top 0.254: U9.7 12.7,16.69 R17.2
N$40
  Top 0.254: U9.6 11.43,16.37 R19.2
N$41
  Top 0.254: D1.C R17.1
N$42
  Top 0.254: D2.C R19.1
N$43
  Top 0.508: P2.P$1 7.16,14.56 | 7.16,14.56 U9.5 | 7.16,14.56 8.38,13.34 J9.2
N$44
  Top 0.254: P14.A4/B9 6.63,25.95
  Top 0.508: J8.1 9.21,27.3 7.71,25.8
  Top 0.61: P14.B4/A9 7.39,21.05 7.94,21.59 7.94,25.57 7.71,25.8 7.56,25.95 6.63,25.95
N$45
  Top 0.305: U10.3 49.05,15.6 48.56,15.6 48.1,16.05 R26.1
N$46
  Top 0.305: P1.B6 9.96,37.35 P9.8
N$47
  Top 0.305: P1.A8 8.87,36.85 10.16,35.56 11.75,35.56 P9.9
N$48
  Top 0.305: P1.B5 8.42,36.35 P9.10
N$49
  Top 0.305: P1.B4/A9 7.85,35.65 9.21,34.29 9.21,33.66 9.84,33.02 11.75,33.02 P9.11
N$50
  Top 0.508: C35.1 32.55,35.29 U11.2 33.63,38.3 40.14,44.81 40.14,47.55 J19.1
N$51  (via drill 0.35)
  other vias: 11.51,20.85
N$52  (via drill 0.35)
  other vias: 12.13,20.85
N$53  (via drill 0.35)
  other vias: 12.76,20.85
N$54  (via drill 0.35)
  other vias: 13.38,20.85
N$55  (via drill 0.35)
  other vias: 13.38,20.22
N$56  (via drill 0.35)
  other vias: 12.76,20.22
N$57  (via drill 0.35)
  other vias: 12.13,20.22
N$58  (via drill 0.35)
  other vias: 11.51,20.22
N$59  (via drill 0.35)
  other vias: 10.89,20.22
N$60  (via drill 0.35)
  other vias: 10.89,19.6
N$61  (via drill 0.35)
  other vias: 11.51,19.6
N$62  (via drill 0.35)
  other vias: 12.13,19.6
N$63  (via drill 0.35)
  other vias: 12.76,19.6
N$64  (via drill 0.35)
  other vias: 13.38,19.6
N$74
  Top 0.254: U8.2 21.27,21.91 21.59,22.23 23.63,22.23 R25.1
N$75
  Top 0.254: C17.1 21.27,24.63 | 21.27,24.63 U8.5 | 21.27,24.63 R15.1
N$76
  Top 0.254: C17.2 20.32,23.95 U8.6 19.68,22.89 19.68,18.73 19.05,18.1 18.35,18.1 | U5.2 18.35,18.1 | 18.35,18.1 18.35,17.78 | 18.35,17.78 U5.3 | U7.2 18.35,14.29 U7.3 | U6.2 18.35,10.79 U6.3 | 18.35,17.78
  Top 0.508: P5.P$2 16.79,10.79 | 16.79,10.79 16.79,11.11 | 16.79,11.11 16.79,14.29 | 16.79,14.29 16.79,17.42 17.14,17.78 18.35,17.78 | 16.79,14.29 18.35,14.29 | 16.79,10.79 18.35,10.79 | 16.79,11.11
N$77
  Top 0.254: R15.2 27.62,21.45 J10.1
  Top 0.508: J9.1 10.16,6.03 11.75,4.45 P5.P$1 14.33,1.91 25.04,1.91 P4.P$1 27.62,4.49 J10.1
N$78
  Top 0.254: U8.1 20.32,16.83 | 20.32,16.83 20.32,13.34 | 20.32,13.34 20.32,10.79 19.36,9.83 U6.4 | U7.4 18.36,13.34 20.32,13.34 | U5.4 18.36,16.83 20.32,16.83
N$79
  pour Top (no thermals): 49.21,14.92 49.21,13.65 48.26,13.65 46.35,13.65 43.81,13.65 42.23,15.24 42.23,21.59 42.23,23.18 43.18,24.13 45.4,24.13 46.35,23.18 46.35,17.78 45.72,17.14 45.72,15.56 46.04,15.24 46.35,14.92 47.31,14.92
N$80
  Top 0.305: U10.8 49.07,13.08 44.69,13.08 C30.2
N$81
  Top 0.305: C21.1 48.9,16.99 49.41,16.47 U10.1
N$82
  Top 0.254: U10.9 46.83,12.54 46.36,12.06 43.9,12.06 42,13.97 41.27,13.97 | J21.3 48.26,22.86 45.72,25.4 38.73,25.4 34.92,21.59 34.92,20
  Top 0.508: P6.P$1 31.75,6.07 31.75,8.89 J10.2 33.78,14.1 C34.1
  pour Top (no thermals): 33.66,23.81 32.7,22.86 32.7,14.61 32.7,14.29 33.66,13.34 33.97,13.02 41.27,13.02 41.59,13.34 41.59,13.65 41.59,15.24 40.96,15.88 38.73,15.88 37.15,17.46 37.15,22.86 36.2,23.81
N$83
  Top 0.254: U10.2 48.73,16.04 48.28,16.49 46.99,17.78 46.99,20.95 47.62,21.59 51.12,21.59 J21.2
N$84
  Top 0.305: R30.1 53.66,16.59 53.11,16.04 U10.19
N$85
  Top 0.305: R29.1 54.09,16.19 53.44,15.54 U10.18
N$86
  Top 0.254: C31.1 56.83,16.33 R29.2
N$87
  Top 0.305: U10.17 57.9,15.04 58.42,15.56 58.42,16.83 J20.2
N$88
  Top 0.305: C32.1 49.24,11.29 U10.10
N$89
  Top 0.254: R28.2 R27.1 60.46,15.42 J20.1
N$90
  Bottom 0.254: R24.2 61.55,20.95 J20.3
N$92
  Top 0.254: P10.2 25.77,49.55 U4.18
N$93
  Top 0.254: P10.3 28.57,49.3 26.67,49.3 25.31,50.66 U4.19
N$94
  Top 0.254: P10.4 26.11,51.76 U4.20
N$95
  Top 0.254: P10.5 28.57,51.84 26.67,51.84 25.65,52.85 U4.21
N$96
  Top 0.254: P10.6 26.45,53.95 U4.22
N$97
  Top 0.254: P10.7 28.57,54.38 26.35,54.38 25.67,55.05 U4.23
N$102
  Top 0.254: P10.12 26.04,60.73 25.86,60.55 U4.28
N$103  (via drill 0.35)
  Top 0.508: J6.1 P10.13 28.55,61.97 26.79,61.97 26.41,61.59 v25.4,61.59 23.37,61.59 U4.29
  Bottom 0.508: C25.1 25.4,62.45 v25.4,61.59
N$104
  Top 0.254: P10.14 26.04,63.27 25.52,62.76 U4.30
N$105
  Top 0.254: P10.15 28.57,64.53 26.35,64.53 25.72,63.9 23.36,63.9 U4.31
N$108
  Top 0.254: P11.2 7.67,63.85 U4.2
N$110
  Top 0.254: P11.4 7.33,61.66 U4.4
N$111
  Top 0.254: P11.5 4.45,61.99 6.03,61.99 7.47,60.55 U4.5
N$112
  Top 0.254: P11.6 6.99,59.45 U4.6
N$113
  Top 0.254: P11.7 4.45,59.45 6.03,59.45 7.13,58.35 U4.7
N$114
  Top 0.254: P11.8 6.64,57.26 U4.8
N$115
  Top 0.254: P11.9 4.45,56.91 6.35,56.91 7.11,56.16 U4.9
N$116
  Top 0.254: P11.10 6.99,55.65 7.58,55.05 U4.10
N$117
  Top 0.254: P11.11 4.45,54.38 6.67,54.38 7.09,53.95 U4.11
N$118
  Top 0.254: P11.12 6.99,53.1 7.24,52.85 U4.12
N$119
  Top 0.254: P11.13 4.45,51.84 9.63,51.84 U4.13
N$120
  Top 0.254: P11.14 6.99,50.56 7.08,50.66 U4.14
N$121
  Top 0.254: P11.15 4.45,49.3 6.99,49.3 7.25,49.55 U4.15
N$123
  Bottom 0.254: J7.2 38.6,60.73 R23.1
N$124
  Bottom 0.254: J12.2 37.65,58.19 R13.1
OP_VCC  (via drill 0.35)
  Top 0.508: v58.74,59.37 58.82,59.45 U2.11
  Bottom 0.254: J1.1 54.29,65.17 54.29,68.58 56.2,70.48 60.01,70.48 R14.3
  Bottom 0.508: J1.1 56.12,62.87 57.09,62.87 C26.1 58.6,59.51 v58.74,59.37
R+
  Top 0.254: P10.10 26.04,58.19 25.86,58.35 U4.26
  Bottom 0.254: J7.1 31.75,60.73 30.48,59.45 28.57,59.45 P10.10
R-
  Top 0.254: P10.11 28.57,59.45 U4.27
VI
  Top 0.508: U3.1 28.98,30.44 J18.1

### Text on the board
bNames: Rev 1